# Altium project PCB_Project.PrjPcb
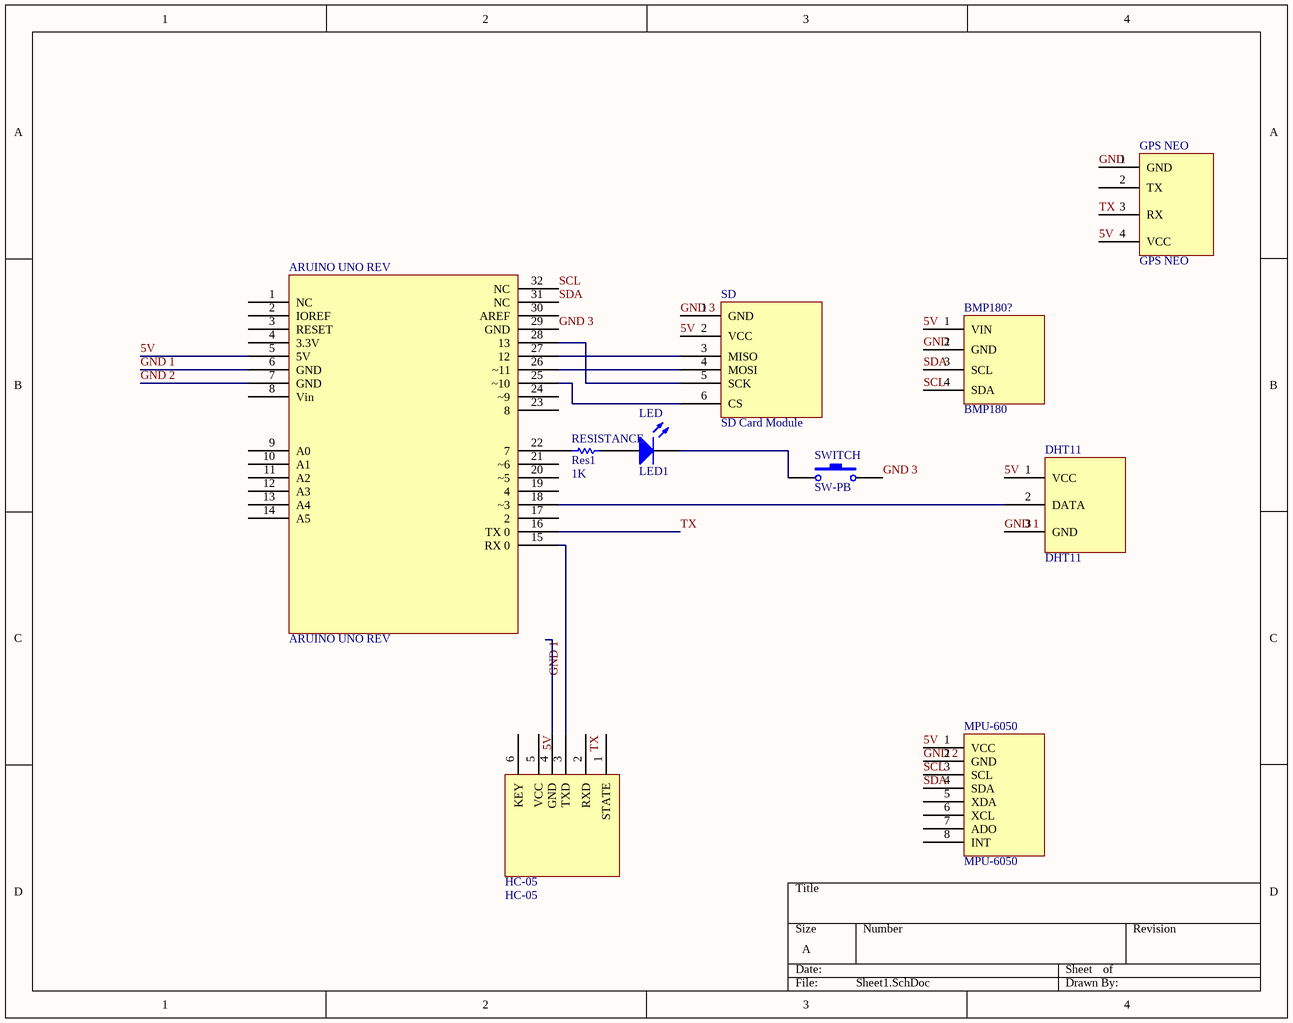
[diagram p0: Sheet1.SchDoc]
1 sheet, 10 parts. Net scope: global (net labels, ports and power ports of the same name join across sheets).
Board file: PCB1.PcbDoc

## Sheet Sheet1.SchDoc
size A; SheetNumber: 1; SheetTotal: 1; SPICEModelCacheGMSLCEKL: <root> / <DocumentId>GMSLCEKL</DocumentId> / <CacheFrame Number="0"> / <Model Name="led1" Kind="MDL"> / <Text>*Typ RED GaAs LED: Vf=1.7V Vr=4V If=40mA trr=3uS / *LED Pinout: 1=A, 2=K / .MODEL LED1 D (IS=93.2P RS=42M N=3.73 BV=4 IBV=10U / + CJO=2.97P VJ=.75 M=.333 TT=4.32U)</Text> / </Model> / </CacheFrame> / </root>

### Parts
ARUINO_UNO_REV  ARUINO UNO REV  [Arduino UNO Rev]
BMP180?  BMP180  [BMP180 - duplicate]
DHT11  DHT11  [DHT11 - duplicate]
GPS_NEO  GPS NEO  [GPS NEO-6M - duplicate]
HC-05  HC-05  [HC05]
LED  LED1  [LED-1]
MPU-6050  MPU-6050  [MPU-6050 - duplicate]
RESISTANCE  Res1  value 1K  [AXIAL-0.3]
SD  SD Card Module  [SD Card Module]
SWITCH  SW-PB  [SPST-2]

### Nets
5V: ARUINO_UNO_REV.5(5V) BMP180?.1(VIN) DHT11.1(VCC) GPS_NEO.4(VCC) HC-05.5(VCC) MPU-6050.1(VCC) SD.2(VCC)
GND: BMP180?.2(GND) GPS_NEO.1(GND)
GND 1: ARUINO_UNO_REV.6(GND) DHT11.3(GND) HC-05.4(GND)
GND 2: ARUINO_UNO_REV.7(GND) MPU-6050.2(GND)
GND 3: ARUINO_UNO_REV.29(GND) SD.1(GND) SWITCH.2
SCL: ARUINO_UNO_REV.32(NC) BMP180?.4(SDA) MPU-6050.3(SCL)
SDA: ARUINO_UNO_REV.31(NC) BMP180?.3(SCL) MPU-6050.4(SDA)
TX: ARUINO_UNO_REV.16(TX_0) GPS_NEO.3(RX) HC-05.2(RXD)
NetARUINO_UNO_REV_15: ARUINO_UNO_REV.15(RX_0) HC-05.3(TXD)
NetARUINO_UNO_REV_18: ARUINO_UNO_REV.18(~3) DHT11.2(DATA)
NetARUINO_UNO_REV_22: ARUINO_UNO_REV.22(7) RESISTANCE.1
NetARUINO_UNO_REV_25: ARUINO_UNO_REV.25(~10) SD.6(CS)
NetARUINO_UNO_REV_26: ARUINO_UNO_REV.26(~11) SD.4(MOSI)
NetARUINO_UNO_REV_27: ARUINO_UNO_REV.27(12) SD.3(MISO)
NetARUINO_UNO_REV_28: ARUINO_UNO_REV.28(13) SD.5(SCK)
NetLED_1: LED.1(A) RESISTANCE.2
NetLED_2: LED.2(K) SWITCH.1

Not connected (* = marked no-connect by the designer): ARUINO_UNO_REV 1(NC) 2(IOREF) 3(RESET) 4(3.3V) 8(Vin) 9(A0) 10(A1) 11(A2) 12(A3) 13(A4) 14(A5) 17(2) 19(4) 20(~5) 21(~6) 23(8) 24(~9) 30(AREF); GPS_NEO 2(TX); HC-05 1(STATE) 6(KEY); MPU-6050 5(XDA) 6(XCL) 7(ADO) 8(INT)

### Library data of the parts
ARUINO_UNO_REV = ARUINO UNO REV: Name: Arduino UNO
LED = LED1: Typical RED GaAs LED; Published: 8-Jun-2000; LatestRevisionDate: 08-Jul-2005; LatestRevisionNote: Mech Layer 1 removed.; PackageReference: LED-1; Publisher: Altium Limited; PackageDescription: LED; 2 Leads
RESISTANCE = Res1: Resistor; Published: 8-Jun-2000; LatestRevisionDate: 17-Jul-2002; LatestRevisionNote: Re-released for DXP Platform.; PackageReference: AXIAL-0.3; Publisher: Altium Limited; PackageDescription: Axial Device, Thru-Hole; 2 Leads; 0.3 in Pin Spacing
SWITCH = SW-PB: Switch; Published: 24-Mar-1999; LatestRevisionDate: 17-Jul-2002; LatestRevisionNote: Re-released for DXP Platform.; PackageReference: SPST-2; Publisher: Altium Limited; PackageDescription: Switch; 2 Leads